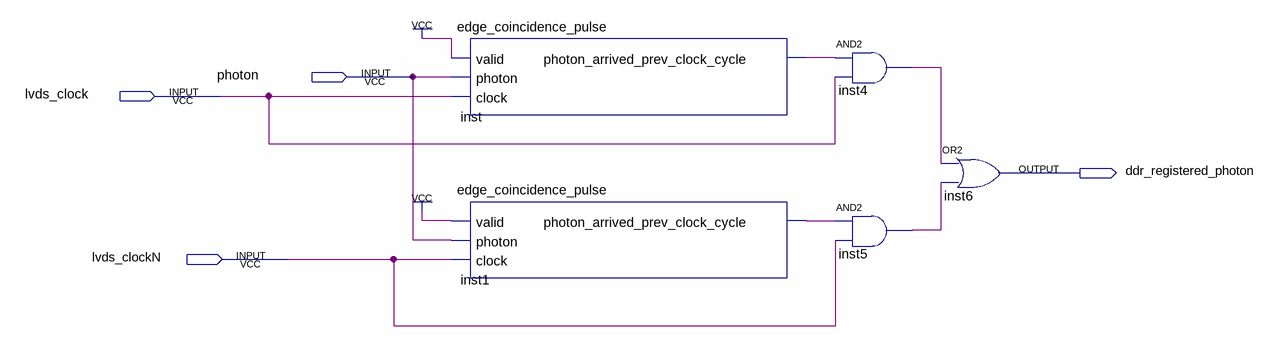
[diagram p0: schematic sheet]
// Quartus schematic registerPhotonsToDDR.bdf as structural Verilog: 5 symbols, 4 pins
module registerPhotonsToDDR (
  input  photon,
  input  lvds_clock,
  input  lvds_clockN,
  output ddr_registered_photon
);

  wire inst1_photon_arrived_prev_clock_cycle, inst4_out, inst5_out, inst_photon_arrived_prev_clock_cycle;

  edge_coincidence_pulse inst (
    .valid(1'b1), .photon(photon), .clock(lvds_clock),
    .photon_arrived_prev_clock_cycle(inst_photon_arrived_prev_clock_cycle));
  edge_coincidence_pulse inst1 (
    .valid(1'b1), .photon(photon), .clock(lvds_clockN),
    .photon_arrived_prev_clock_cycle(inst1_photon_arrived_prev_clock_cycle));
  and inst4 (inst4_out, inst_photon_arrived_prev_clock_cycle, lvds_clock);
  and inst5 (inst5_out, inst1_photon_arrived_prev_clock_cycle, lvds_clockN);
  or inst6 (ddr_registered_photon, inst4_out, inst5_out);
endmodule
